# EAGLE design SerLCD_20x4_pb (EAGLE 9.5.2)
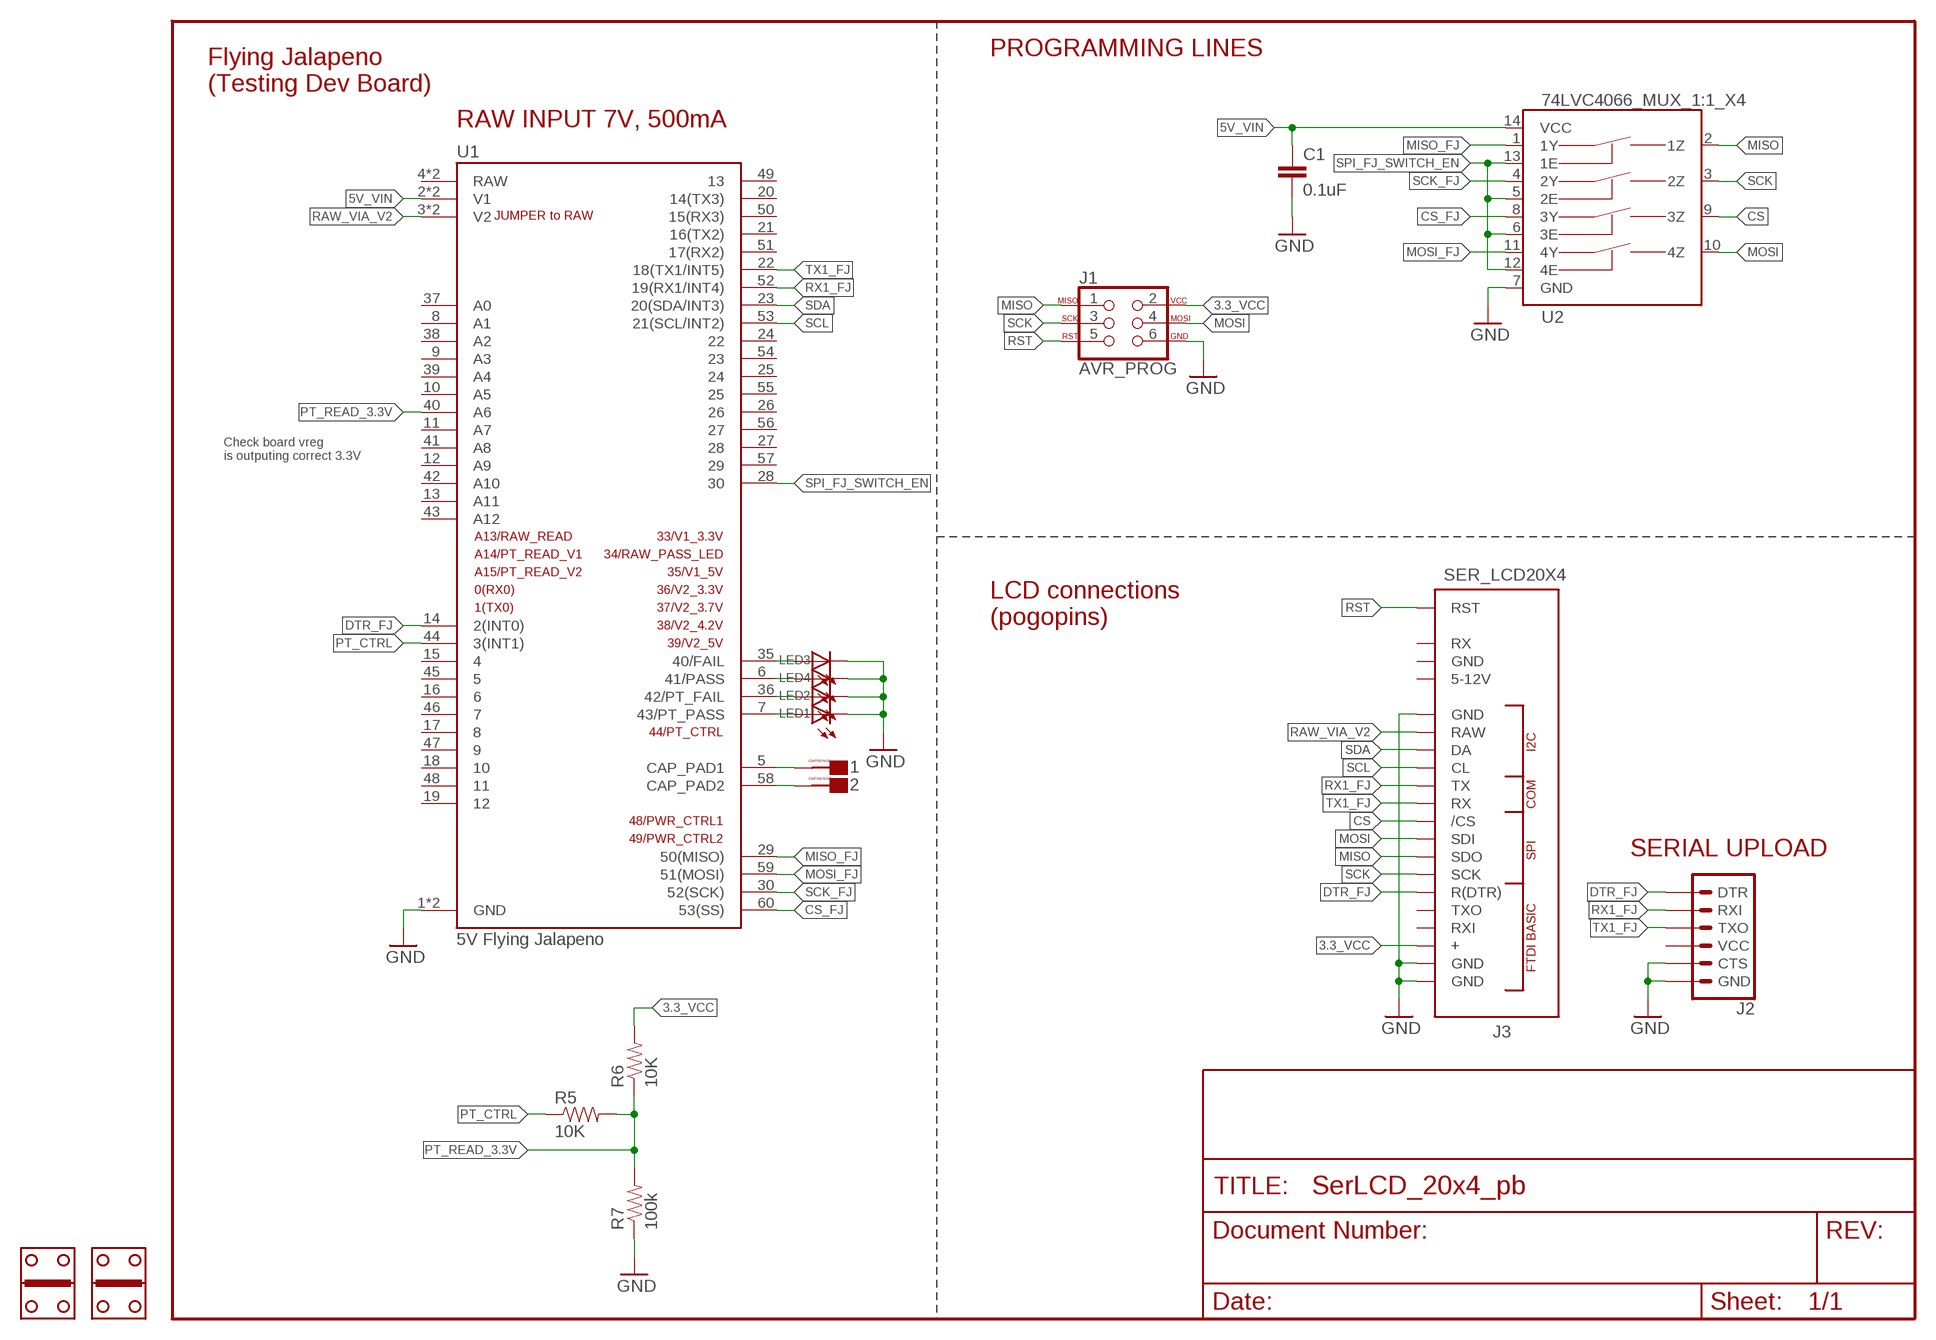
[diagram p0: schematic, sheet 1]

## Parts
1  CAPSENSE_BUTTON_PAD_ONLY  [CAPSENSE_BUTTON_PADS_ONLY]
2  CAPSENSE_BUTTON_PAD_ONLY  [CAPSENSE_BUTTON_PADS_ONLY]
C1  0.1uF  CAP0603-CAP  [0603-CAP]
J1  AVR_PROG  AVR_SPI_PROG_3X22X3_LOCK  [2X3_LOCK]
J2  6_PIN_SERIAL_TARGETLOCK  [1X06_LOCK]
J3  SER_LCD20X4  [SER_LCD_20X4]
LED1  LED1206  [LED-1206]
LED2  LED1206  [LED-1206]
LED3  LED1206  [LED-1206]
LED4  LED1206  [LED-1206]
R5  10K  10KOHM1/10W1%(0603)0603  [0603-RES]
R6  10K  10KOHM1/10W1%(0603)0603  [0603-RES]
R7  100k  100KOHM1/10W1%(0603)  [0603-RES]
U1  5V Flying Jalapeno  FLYING_JALAPENO_V3MALE  [FLYING_JALAPENO_V3_1_M]
U2  74LVC4066_MUX_1:1_X4  [SO14]
U$6  GOLD_HINDGEPB  [GOLD_HINDGE]
U$7  GOLD_HINDGEPB  [GOLD_HINDGE]

## Nets
3.3_VCC: J1.2 J3.P$3(+) R6.2
5V_VIN [twelve_mil]: C1.1 U1.2(V1) U1.32(V1) U2.14(VCC)
CS: J3.P$10(/CS) U2.9(3Z)
CS_FJ: U1.60(53(SS)) U2.8(3Y)
DTR_FJ: J2.1(DTR) J3.P$6(R(DTR)) U1.14(2(INT0))
GND [twelve_mil]: C1.2 J1.6 J2.5(CTS) J2.6(GND) J3.P$1(GND) J3.P$2(GND) J3.P$16(GND) LED1.C LED2.C LED3.C LED4.C R7.1 U1.1(GND) U1.31(GND) U2.7(GND)
MISO: J1.1 J3.P$8(SDO) U2.2(1Z)
MISO_FJ: U1.29(50(MISO)) U2.1(1Y)
MOSI: J1.4 J3.P$9(SDI) U2.10(4Z)
MOSI_FJ: U1.59(51(MOSI)) U2.11(4Y)
N$1 [eight_mil]: 1.CAPSENSE_PAD(CAPSENSE) U1.5(CAP_PAD1)
N$2: 2.CAPSENSE_PAD(CAPSENSE) U1.58(CAP_PAD2)
N$3 [eight_mil]: LED1.A U1.7(43/PT_PASS)
N$4 [eight_mil]: LED2.A U1.36(42/PT_FAIL)
N$5: LED3.A U1.35(40/FAIL)
N$6: LED4.A U1.6(41/PASS)
PT_CTRL: R5.1 U1.44(3(INT1))
PT_READ_3.3V: R5.2 R6.1 R7.2 U1.40(A6)
RAW_VIA_V2: J3.P$15(RAW) U1.3(V2) U1.33(V2)
RST: J1.5 J3.P$20(RST)
RX1_FJ: J2.2(RXI) J3.P$12(TX) U1.52(19(RX1/INT4))
SCK: J1.3 J3.P$7(SCK) U2.3(2Z)
SCK_FJ: U1.30(52(SCK)) U2.4(2Y)
SCL: J3.P$13(CL) U1.53(21(SCL/INT2))
SDA: J3.P$14(DA) U1.23(20(SDA/INT3))
SPI_FJ_SWITCH_EN: U1.28 U2.5(2E) U2.6(3E) U2.12(4E) U2.13(1E)
TX1_FJ: J2.3(TXO) J3.P$11(RX) U1.22(18(TX1/INT5))
Unconnected: J2.4(VCC) J3.P$4(RXI) J3.P$5(TXO) J3.P$17(5-12V) J3.P$18(GND) J3.P$19(RX) U1.4(RAW) U1.8(A1) U1.9(A3) U1.10(A5) U1.11(A7) U1.12(A9) U1.13(A11) U1.15 U1.16 U1.17 U1.18 U1.19 U1.20(14(TX3)) U1.21(16(TX2)) U1.24 U1.25 U1.26 U1.27 U1.34(RAW) U1.37(A0) U1.38(A2) U1.39(A4) U1.41(A8) U1.42(A10) U1.43(A12) U1.45 U1.46 U1.47 U1.48 U1.49 U1.50(15(RX3)) U1.51(17(RX2)) U1.54 U1.55 U1.56 U1.57

## Notes on the sheet
- PROGRAMMING LINES
- Flying Jalapeno
  (Testing Dev Board)
- RAW INPUT 7V, 500mA
- JUMPER to RAW
- Check board vreg 
  is outputing correct 3.3V
- LCD connections
  (pogopins)
- SERIAL UPLOAD

## Library data of the parts
1 2 = Testing:CAPSENSE_BUTTON_PAD_ONLY
C1 = Testing:CAP: Capacitor Standard 0603 ceramic capacitor, and 0.1" leaded capacitor.
J1 = SparkFun-Connectors:AVR_SPI_PROG_3X2: AVR ISP 6 Pin This is the reduced ISP connector for AVR programming. Common on Arduino. This footprint will take up less PCB space and can be used with a 10-pin to 6-pin adapter such as SKU: BOB-08508 **Special note about "TEST_POINT" package. The stop mask is on the top side, so if you want your programming test points to be on the bottom of your board, make sure to place this package on the bottom side of the board. This also ensure that the orientation to program from the bottom side will be correct.
J2 = SparkFun-Connectors:6_PIN_SERIAL_TARGET: 6-pin header connection for use with the "FTDI BASIC" pinout - TARGET SIDE. Also known as "Arduino Serial Program Header". It is used to mate with our FTDI Basic serial programmers using the Arduino IDE. Note, this device has "TARGET" in the name. It is intended to be used on a design that contains a target micro-controller that you wish to program. The "sister" device, named "CABLE" is inteneded to be used on a design that usually lives on the end of your USB cable and prvides the converter chip (FTDI232 or FTDI231x) to commnicate serial RX/TX. You can populate with some of these: Break Away Headers - Straight <https://www.sparkfun.com/products/116> (PRT-00116) For reference (or to suit your programming needs) check out these designs: SparkFun FTDI Basic Breakout - 5V <https://www.sparkfun.com/products/9716> (DEV-09716) SparkFun FTDI Basic Breakout - 3.3V <https://www.sparkfun.com/products/9873> (DEV-09873) SparkFun FTDI SmartBasic <https://www.sparkfun.com/products/12935> (DEV-12935) SparkFun Beefy 3 - FTDI Basic Breakout <https://www.sparkfun.com/products/13746> (DEV-13746)
J3 = SerLCD_dimensions:SER_LCD
LED1-LED4 = Testing:LED: LEDs Standard schematic elements and footprints for 5mm, 3mm, 1206, and 0603 sized LEDs. 5mm - Spark Fun Electronics SKU : COM-00529 (and others)
R5 R6 = SparkFun-Resistors:10KOHM1/10W1%(0603): RES-00824; PROD_ID: RES-00824
R7 = SparkFun-Resistors:100KOHM1/10W1%(0603): RES-07828; PROD_ID: RES-07828
U1 = Testing:FLYING_JALAPENO_V3
U2 = Testing:74LVC4066_MUX_1:1_X4
U$6 U$7 = Testing:GOLD_HINDGE

## Net classes
1 vcc1: width 0.203 mm
3 VCC2: width 0.381 mm, drill 0.508 mm, clearance 0.254 mm to class 0
8 eight_mil: width 0.203 mm, clearance 0.127 mm
9 twelve_mil: width 0.305 mm, clearance 0.127 mm
10 twenty_mil: width 0.508 mm, clearance 0.127 mm
11 thirty_mil: width 0.762 mm, clearance 0.127 mm
13 20_mil: width 0.508 mm, drill 0.508 mm

## Board
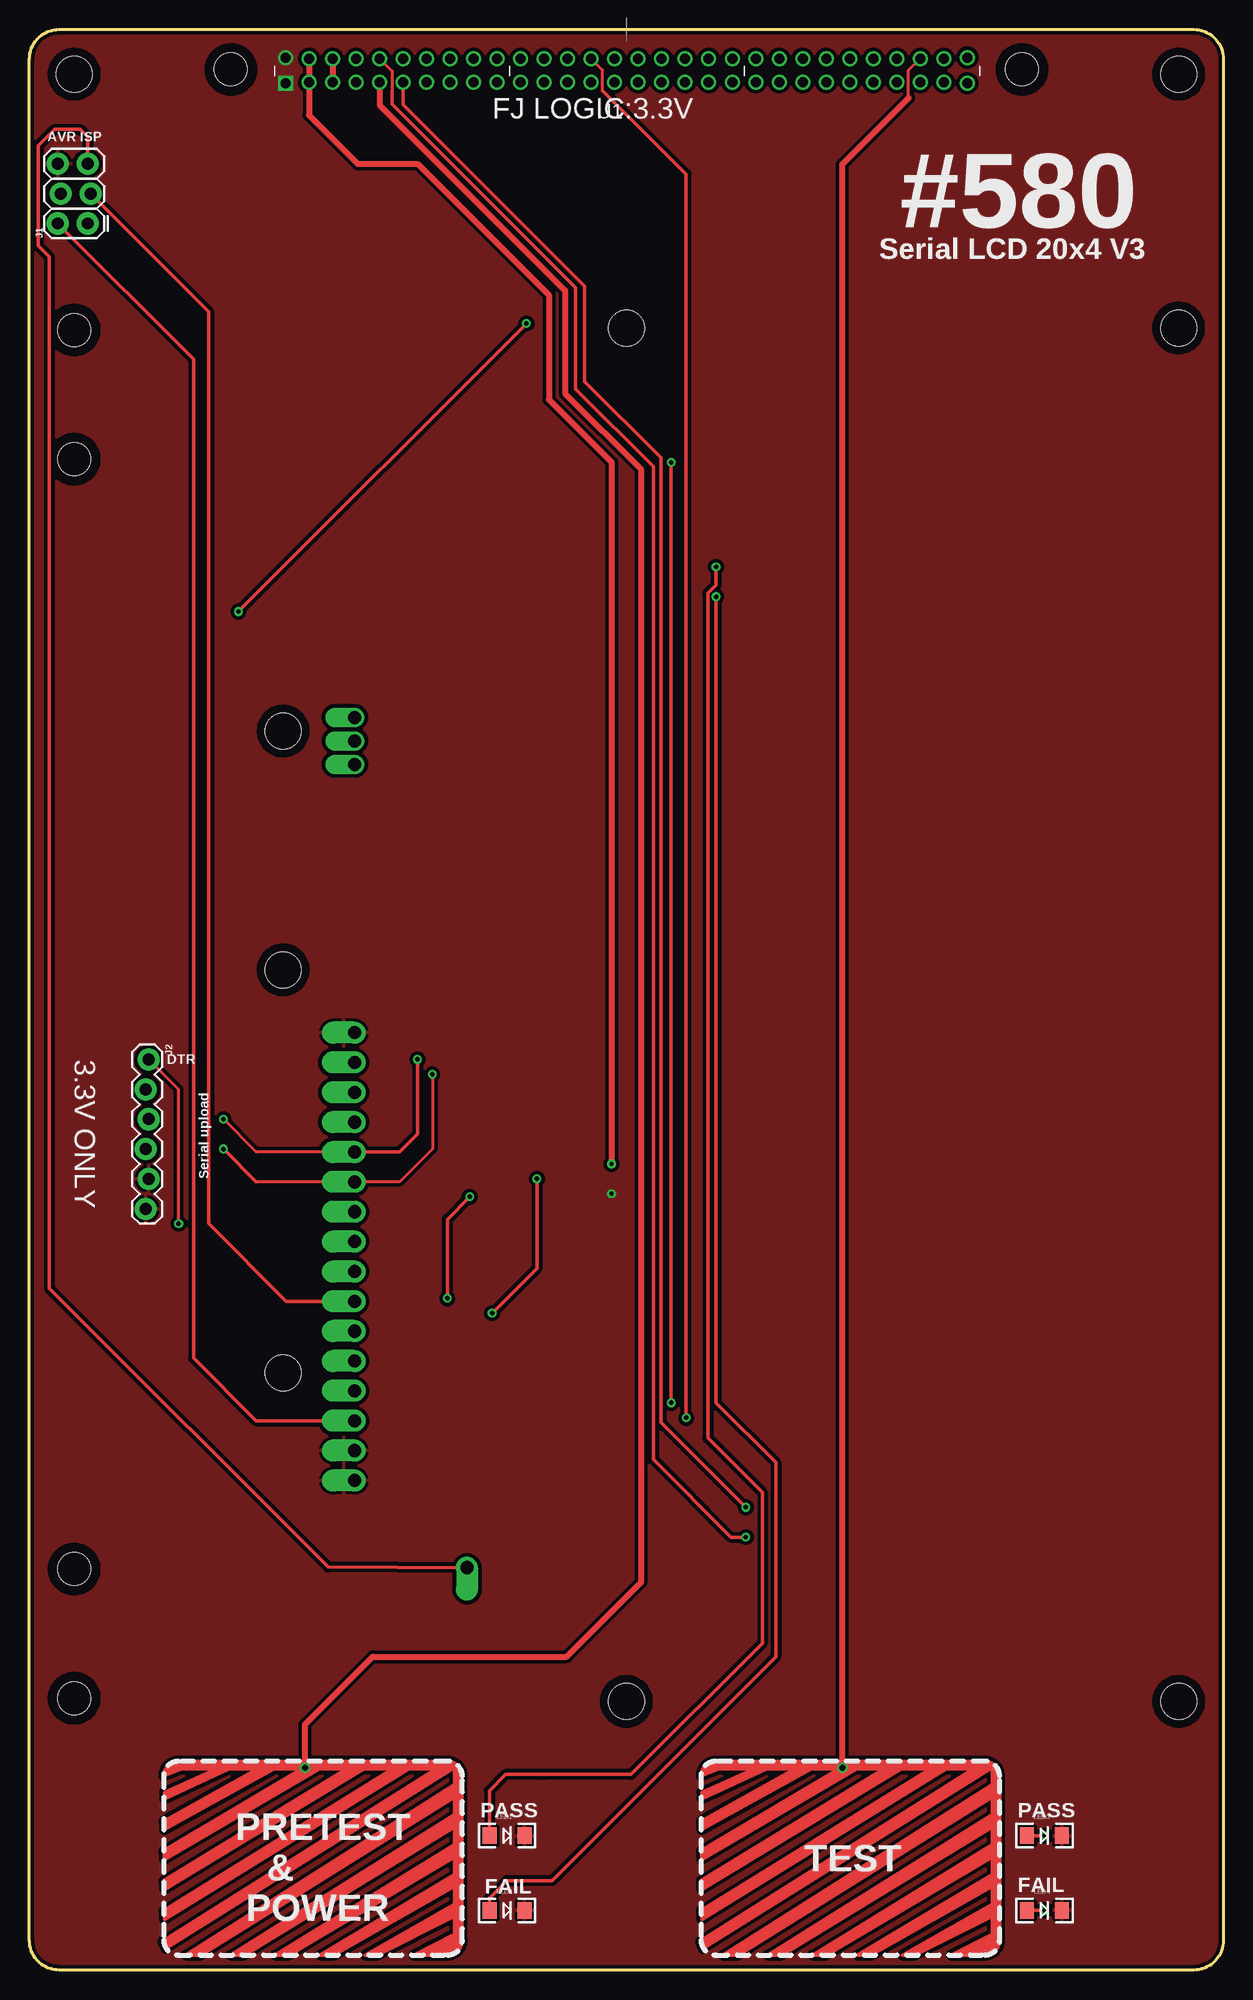
[diagram p1: board, top side]
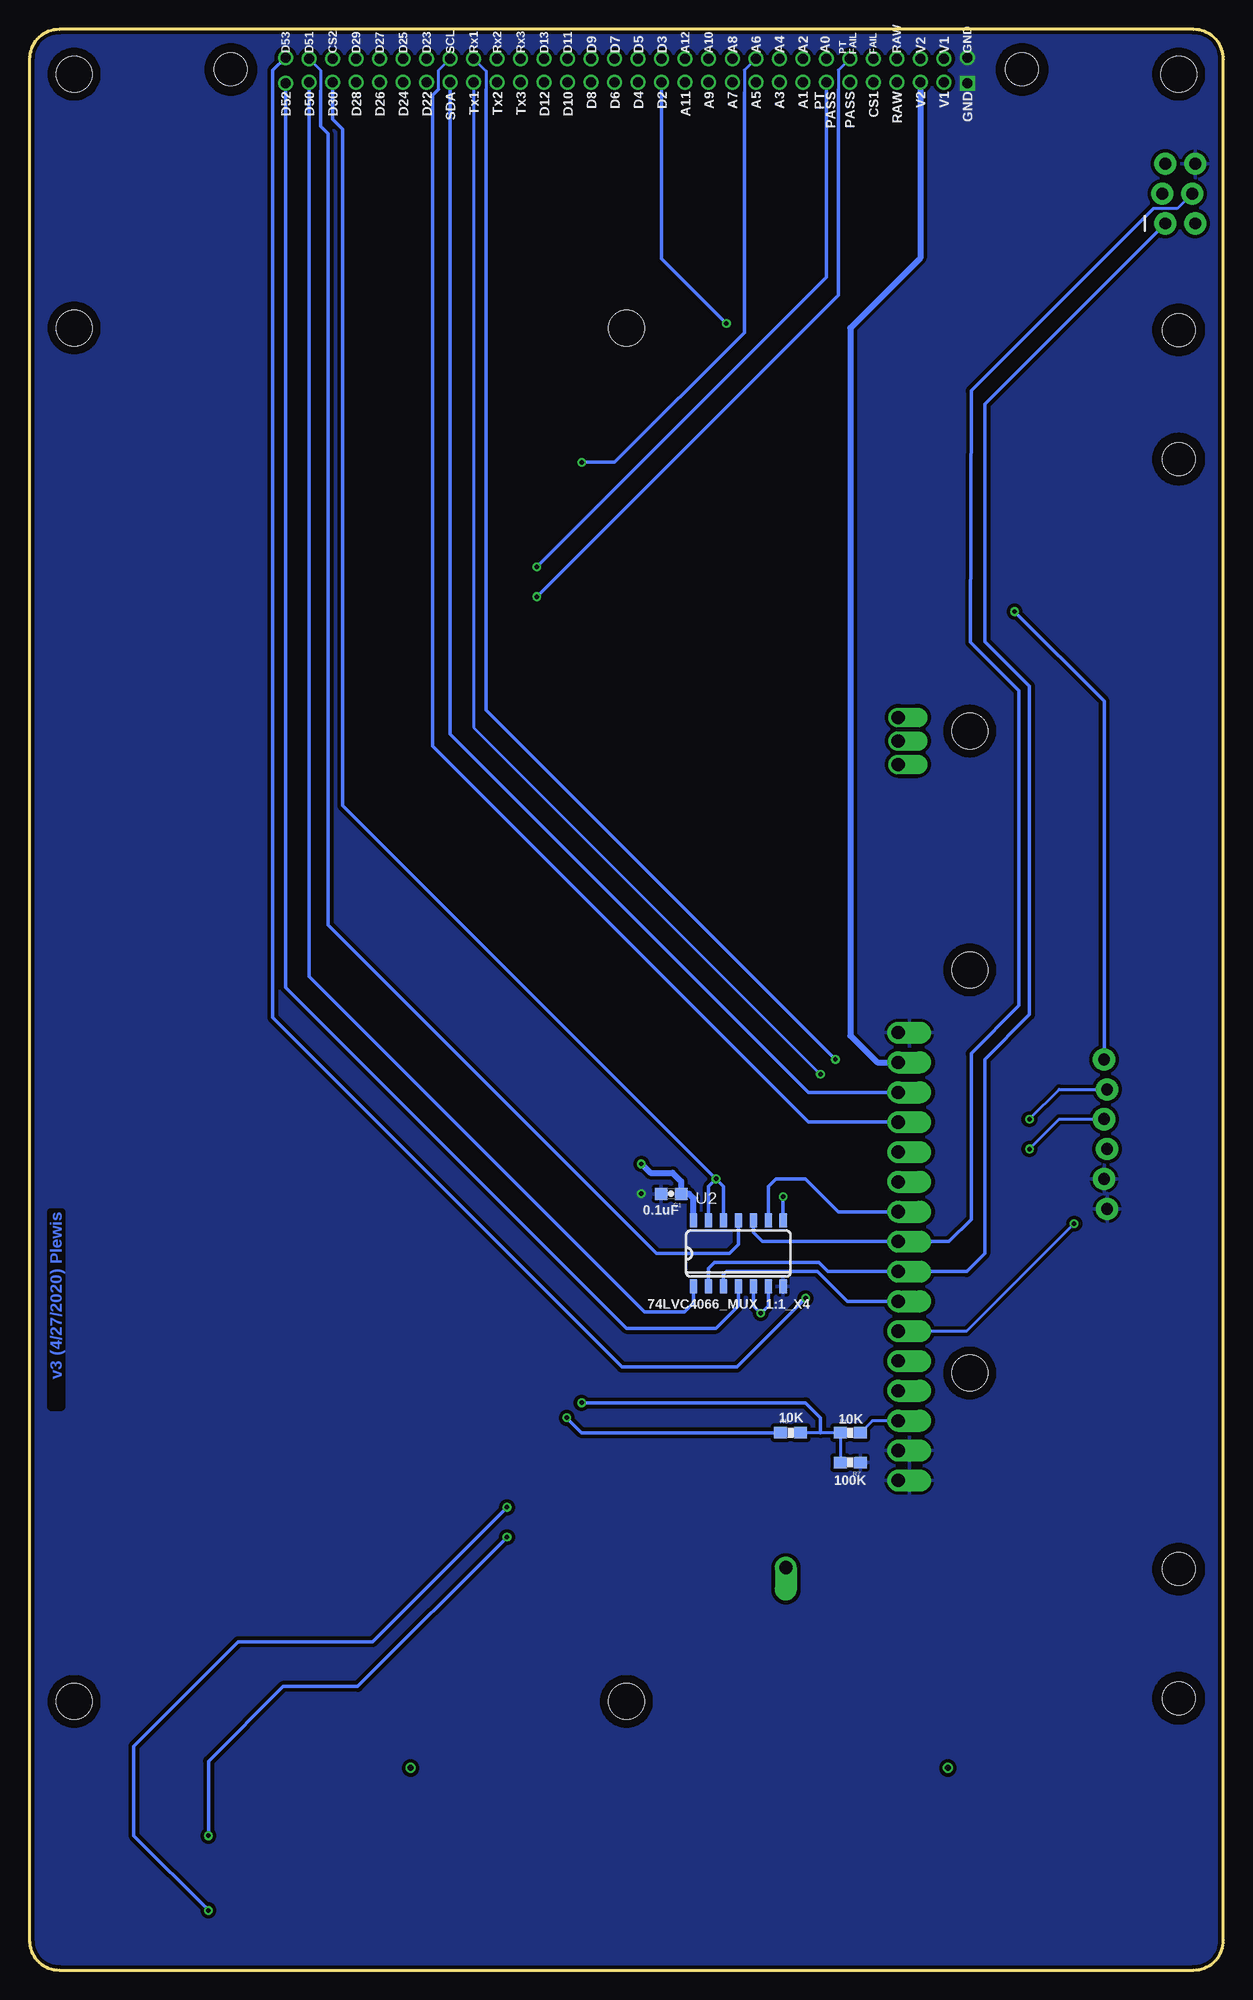
[diagram p2: board, bottom side, seen from below]

Size 101.6 x 165.1 mm. Coordinates in mm from the lower left corner, seen from the top.
Outline: 2.54,0 arc-90 0,2.54 0,162.56 arc-90 2.54,165.1 99.06,165.1 arc-90 101.6,162.56 101.6,2.54 arc-90 99.06,0 2.54,0
Copper layers (1*16): Top 0.035mm / dielectric 1.5mm / Bottom 0.035mm
Design rules "SparkFun-2-layer-TIGHT *": minimum track width 10mil, minimum drill 15mil, track to track 7mil, track to pad 7mil, pad to pad 7mil, via to via 7mil, smd to smd 7mil, copper to edge 7mil, drill to drill 7mil, minimum pad ring 7mil, minimum via ring 7mil, stop-mask expansion 4mil, vias tented up to drill 25mil, thermal gap 10mil

### Footprints (pad centres in the part's own frame; a part is rotated, then mirrored left to right if it is on the bottom)
CAPSENSE_BUTTON_PADS_ONLY = drill 0.508: CAPSENSE_PAD -0.686,7.036
0603-CAP = smd 1.1 x 1: 1 -0.85,0; 2 0.85,0
2X3_LOCK = drill 1.016 pad 1.88: 1 0,0.127; 2 0,2.667; 3 2.54,-0.127; 4 2.54,2.413; 5 5.08,0.127; 6 5.08,2.667
1X06_LOCK = drill 1.016 pad 1.88: 1 0,0; 2 2.54,-0.254; 3 5.08,0; 4 7.62,-0.254; 5 10.16,0; 6 12.7,-0.254
SER_LCD_20X4 = drill 1.118 pad 1.88 offset: P$1 9.906,57.404; P$2 12.446,57.404; P$3 14.986,57.404; P$4 17.526,57.404; P$5 20.066,57.404; P$6 22.606,57.404; P$7 25.146,57.404; P$8 27.686,57.404; P$9 30.226,57.404; P$10 32.766,57.404; P$11 35.306,57.404; P$12 37.846,57.404; P$13 40.386,57.404; P$14 42.926,57.404; P$15 45.466,57.404; P$16 48.006,57.404; P$20 2.489,47.854 | drill 1.118 pad 1.524 offset: P$17 70.815,57.404; P$18 72.815,57.404; P$19 74.815,57.404
LED-1206 = smd 1.2 x 1.4: A -1.5,0; C 1.5,0
0603-RES = smd 1.1 x 1: 1 -0.85,0; 2 0.85,0
FLYING_JALAPENO_V3_1_M = drill 0.85 square: 1 -29,-4.592 | drill 0.85: 2 -27,-4.492; 3 -25,-4.492; 4 -23,-4.492; 5 -21,-4.492; 6 -19,-4.492; 7 -17,-4.492; 8 -15,-4.492; 9 -13,-4.492; 10 -11,-4.492; 11 -9,-4.492; 12 -7,-4.492; 13 -5,-4.492; 14 -3,-4.492; 15 -1,-4.492; 16 1,-4.492; 17 3,-4.492; 18 5,-4.492; 19 7,-4.492; 20 9,-4.492; 21 11,-4.492; 22 13,-4.492; 23 15,-4.492; 24 17,-4.492; 25 19,-4.492; 26 21,-4.492; 27 23,-4.492; 28 25,-4.492; 29 27,-4.492; 30 29,-4.592; 31 -29,-2.392; 32 -27,-2.492; 33 -25,-2.492; 34 -23,-2.492; 35 -21,-2.492; 36 -19,-2.492; 37 -17,-2.492; 38 -15,-2.492; 39 -13,-2.492; 40 -11,-2.492; 41 -9,-2.492; 42 -7,-2.492; 43 -5,-2.492; 44 -3,-2.492; 45 -1,-2.492; 46 1,-2.492; 47 3,-2.492; 48 5,-2.492; 49 7,-2.492; 50 9,-2.492; 51 11,-2.492; 52 13,-2.492; 53 15,-2.492; 54 17,-2.492; 55 19,-2.492; 56 21,-2.492; 57 23,-2.492; 58 25,-2.492; 59 27,-2.492; 60 29,-2.392 | hole 2.794: 33.655,-3.404; -33.655,-3.404
SO14 = smd 0.6 x 1.2: 1 -3.175,-2.8; 2 -1.905,-2.8; 3 -0.635,-2.8; 4 0.635,-2.8; 5 1.905,-2.8; 6 3.175,-2.8; 7 4.445,-2.8; 8 4.445,2.8; 9 3.175,2.8; 10 1.905,2.8; 11 0.635,2.8; 12 -0.635,2.8; 13 -1.905,2.8; 14 -3.175,2.8
STAND-OFF-TIGHT = hole 3.048: 0,0
GOLD_HINDGE = hole 2.794: 3.81,4.077; 3.81,15.07

### Placement (x,y rotation side)
1  24.13,10.16 0 top
2  69.85,10.16 0 top
C1  46.99,66.04 180 bottom
J1  5.08,148.59 90 top
J2  10.16,77.47 270 top
J3  85.09,31.75 90 top
LED1  40.64,11.43 0 top
LED2  40.64,5.08 0 top
LED3  86.36,11.43 0 top
LED4  86.36,5.08 0 top
R5  36.83,45.72 0 bottom
R6  31.75,45.72 0 bottom
R7  31.75,43.18 180 bottom
U1  50.8,165.1 0 top
U2  41.91,60.96 0 bottom
U$1  [STAND-OFF-TIGHT]  97.79,161.29 0 top
U$2  [STAND-OFF-TIGHT]  3.81,161.29 0 top
U$3  [STAND-OFF-TIGHT]  97.79,139.7 0 top
U$4  [STAND-OFF-TIGHT]  21.59,50.8 0 top
U$5  [STAND-OFF-TIGHT]  21.59,85.09 0 top
U$6  0,124.46 0 top
U$7  0,19.05 0 top
U$8  [STAND-OFF-TIGHT]  97.79,22.86 0 top
U$9  [STAND-OFF-TIGHT]  21.59,105.41 0 top
U$10  [STAND-OFF-TIGHT]  50.8,22.86 0 top
U$11  [STAND-OFF-TIGHT]  50.8,139.7 0 top

### Tracks (layer width: path | path; a pad name or v marks a point on that pad's centre or on a via)
3.3_VCC
  Top 0.305: J1.2 13.97,137.03 13.97,52.07 19.3,46.74 J3.P$3
  Bottom 0.254: J3.P$3 29.88,46.74 R6.2
5V_VIN  (via drill 0.38)
  Top 0.508: U1.32 U1.2 23.8,157.81 27.94,153.67 33.02,153.67 44.2,142.49 44.2,133.6 49.53,128.27 v49.53,68.58
  Bottom 0.508: v49.53,68.58 48.77,67.82 46.86,67.82 46.14,67.09 C1.1 45.47,66.04 45.09,65.66 U2.14
CS
  Bottom 0.305: J3.P$10 32.77,64.52 35.56,67.31 38.1,67.31 38.73,66.67 U2.9
CS_FJ  (via drill 0.38)
  Top 0.305: v35.56,57.15 35.56,63.88 v37.47,65.79
  Bottom 0.305: U1.60 80.9,161.61 80.9,81.03 51.18,51.31 41.4,51.31 v35.56,57.15 | v37.47,65.79 U2.8
DTR_FJ  (via drill 0.38)
  Top 0.254: v12.7,63.5 12.7,74.93 J2.1
  Top 0.305: v17.78,115.57 v42.29,140.08
  Bottom 0.254: J3.P$6 21.84,54.36 v12.7,63.5
  Bottom 0.305: J2.1 10.16,107.95 v17.78,115.57 | v42.29,140.08 47.8,145.59 U1.14
GND  (via drill 0.38)
  other vias: 49.53,66.04
  pour Bottom (isolate 0.305): 0,0 0,165.1 101.6,165.1 101.6,0
  pour Top (isolate 0.305): 0,0 0,165.1 101.6,165.1 101.6,0
MISO
  Bottom 0.305: U2.2 43.81,59.69 43.31,60.2 34.42,60.2 33.66,59.44 J3.P$8 21.84,59.44 20.32,60.96 20.32,77.47 16.51,81.28 16.51,109.22 20.32,113.03 20.32,133.22 J1.1
MISO_FJ
  Bottom 0.305: U1.29 77.8,84.53 49.28,56.01 45.85,56.01 45.09,56.77 U2.1
MOSI
  Bottom 0.254: J1.4 3.94,149.86 5.97,149.86
  Bottom 0.305: U2.10 40.01,62.74 39.24,61.98 J3.P$9 23.37,61.98 21.46,63.88 21.46,77.98 17.4,82.04 17.4,108.84 21.53,112.97 21.46,134.37 5.97,149.86
MOSI_FJ
  Bottom 0.254: U1.59 76.83,161.64 76.83,159.89
  Bottom 0.305: 76.83,159.89 76.83,156.84 76.2,156.21 76.2,88.9 48.26,60.96 42.04,60.96 41.27,61.72 U2.11
N$1
  Top 0.508: 1.CAPSENSE_PAD 23.44,20.9 29.21,26.67 45.72,26.67 52.07,33.02 52.07,127.64 45.59,134.11 45.59,142.88 29.8,158.67 U1.5
N$2
  Top 0.254: U1.58 74.8,161.61 74.8,159.26
  Top 0.508: 2.CAPSENSE_PAD 69.16,153.62 74.8,159.26
N$3  (via drill 0.38)
  Top 0.305: v58.42,119.38 58.42,117.83 57.72,117.13 57.72,45.28 62.36,40.64 62.36,27.81 51.18,16.64 43.81,16.64 43.31,16.64 40.51,16.64 39.14,15.26 LED1.A
  Bottom 0.305: U1.7 33.8,144 v58.42,119.38
N$4  (via drill 0.38)
  Top 0.305: v58.42,116.84 58.42,48.26 63.5,43.18 63.5,26.67 44.45,7.62 40.64,7.62 39.14,6.12 LED2.A
  Bottom 0.254: U1.36 32.77,161.64 32.77,160.02
  Bottom 0.305: 32.77,160.02 32.77,142.49 v58.42,116.84
N$5  (via drill 0.38)
  Top 0.254: U1.35 30.86,161.55 30.86,161 30.86,160.22 30.86,160.21 30.86,159.89
  Top 0.305: 30.86,159.89 30.86,158.75 46.48,143.13 46.48,134.49 53.09,127.89 53.09,43.43 59.69,36.83 v60.96,36.83 | v86.36,11.43 LED3.A
  Bottom 0.305: v60.96,36.83 73.66,24.13 80.01,24.13 86.36,17.78 v86.36,11.43
N$6  (via drill 0.38)
  Top 0.305: U1.6 31.8,158.7 47.24,143.26 47.24,135.13 53.72,128.65 53.72,46.61 v60.96,39.37 | LED4.A v86.36,5.08
  Bottom 0.305: v60.96,39.37 72.39,27.94 83.82,27.94 92.71,19.05 92.71,11.43 v86.36,5.08
PT_CTRL  (via drill 0.38)
  Top 0.254: 48.77,159.89 48.77,161.64 U1.44
  Top 0.305: v55.88,46.99 55.88,152.78 48.77,159.89
  Bottom 0.305: R5.1 54.61,45.72 v55.88,46.99
PT_READ_3.3V  (via drill 0.38)
  Top 0.305: v54.61,128.27 v54.61,48.26
  Bottom 0.254: R5.2 34.29,45.72 R6.1 R7.2 | U1.40 40.77,161.64 40.77,159.77
  Bottom 0.305: 40.77,159.77 40.77,139.32 51.82,128.27 v54.61,128.27 | v54.61,48.26 35.56,48.26 34.29,46.99 34.29,45.72
RAW_VIA_V2
  Top 0.508: U1.33 U1.3
  Bottom 0.508: U1.3 25.8,145.65 31.75,139.7 31.75,79.5 29.46,77.22 J3.P$15
RST
  Top 0.305: J3.P$20 25.4,34.29 1.7,57.99 1.7,145.75 0.76,146.69 0.76,155.19 2.16,156.59 4.32,156.59 4.95,155.96 J1.5
RX1_FJ  (via drill 0.38)
  Top 0.254: J3.P$12 19.3,69.6 v16.51,72.39
  Top 0.305: v33.02,77.47 33.02,71.12 31.5,69.6 J3.P$12
  Bottom 0.254: v16.51,72.39 13.97,74.93 J2.2 | U1.52 62.74,161.55 62.74,161 62.74,160.22 62.74,160.21 62.74,160.02
  Bottom 0.305: 62.74,160.02 62.74,107.19 v33.02,77.47
SCK
  Top 0.305: J1.3 15.24,141.1 15.24,63.5 21.84,56.9 J3.P$7
  Bottom 0.305: J3.P$7 32,56.9 34.54,59.44 42.29,59.44 42.55,59.18 U2.3
SCK_FJ
  Bottom 0.305: U1.30 79.8,83.61 50.8,54.61 43.18,54.61 41.27,56.52 U2.4
SCL
  Bottom 0.254: U1.53 66.8,161.61 66.8,160.02
  Bottom 0.305: J3.P$13 35.31,72.14 67.31,104.14 67.31,159.51 66.8,160.02
SDA
  Bottom 0.305: U1.23 65.8,105.17 35.31,74.68 J3.P$14
SPI_FJ_SWITCH_EN  (via drill 0.38)
  Top 0.305: v43.18,67.31 43.18,59.69 v39.37,55.88
  Bottom 0.305: U1.28 75.8,157.46 74.93,156.59 74.93,99.06 v43.18,67.31 | U2.6 38.73,56.52 v39.37,55.88 40.01,56.52 U2.5 | U2.12 42.55,66.67 v43.18,67.31 | U2.13 43.81,66.67 v43.18,67.31
TX1_FJ  (via drill 0.38)
  Top 0.254: 19.3,67.06 J3.P$11 31.5,67.06 34.29,69.85 v34.29,76.2
  Top 0.305: 19.3,67.06 v16.51,69.85
  Bottom 0.254: v16.51,69.85 13.97,72.39 J2.3 | U1.22 63.8,105.71 v34.29,76.2

### Text on the board
Bottom: v3 (4/27/2020) Plewis
tPlace: FJ LOGIC:3.3V | AVR ISP | #580 | Serial LCD 20x4 V3 | 3.3V ONLY | DTR | Serial upload | PASS | PASS | TEST | FAIL | FAIL | PRETEST / & / POWER
bPlace: 0.1uF | 10K | 10K | 100K